# EAGLE design BusPirate-ng.v1.0 (EAGLE 7.6.0)
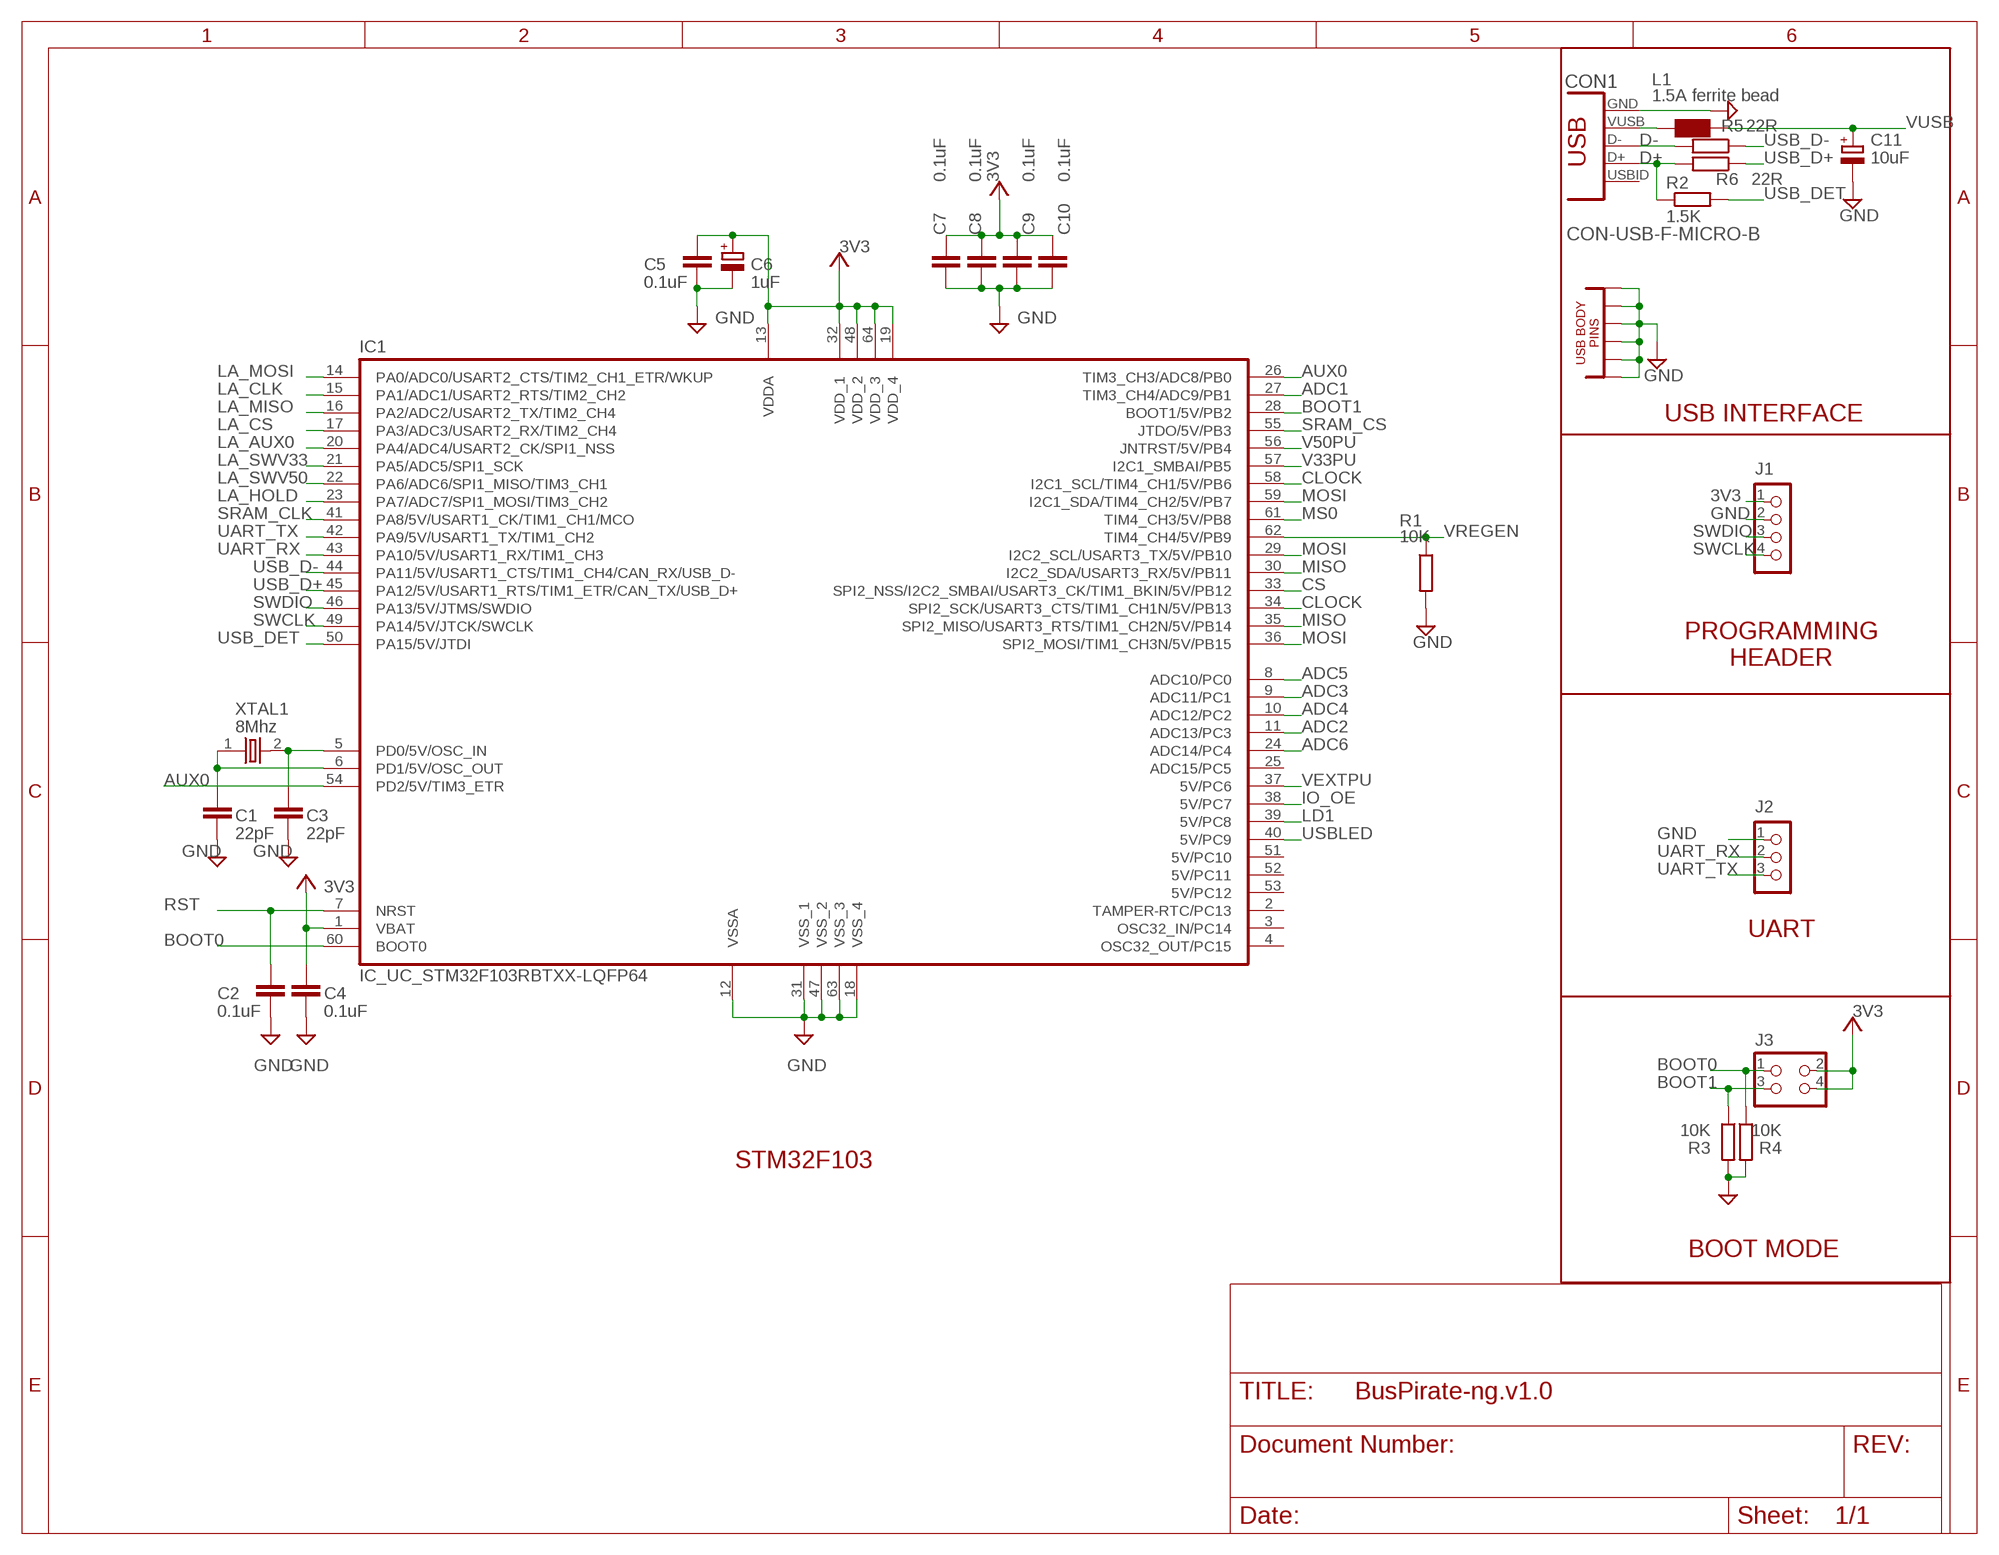
[diagram p0: schematic, sheet 1, part 1 of 2]
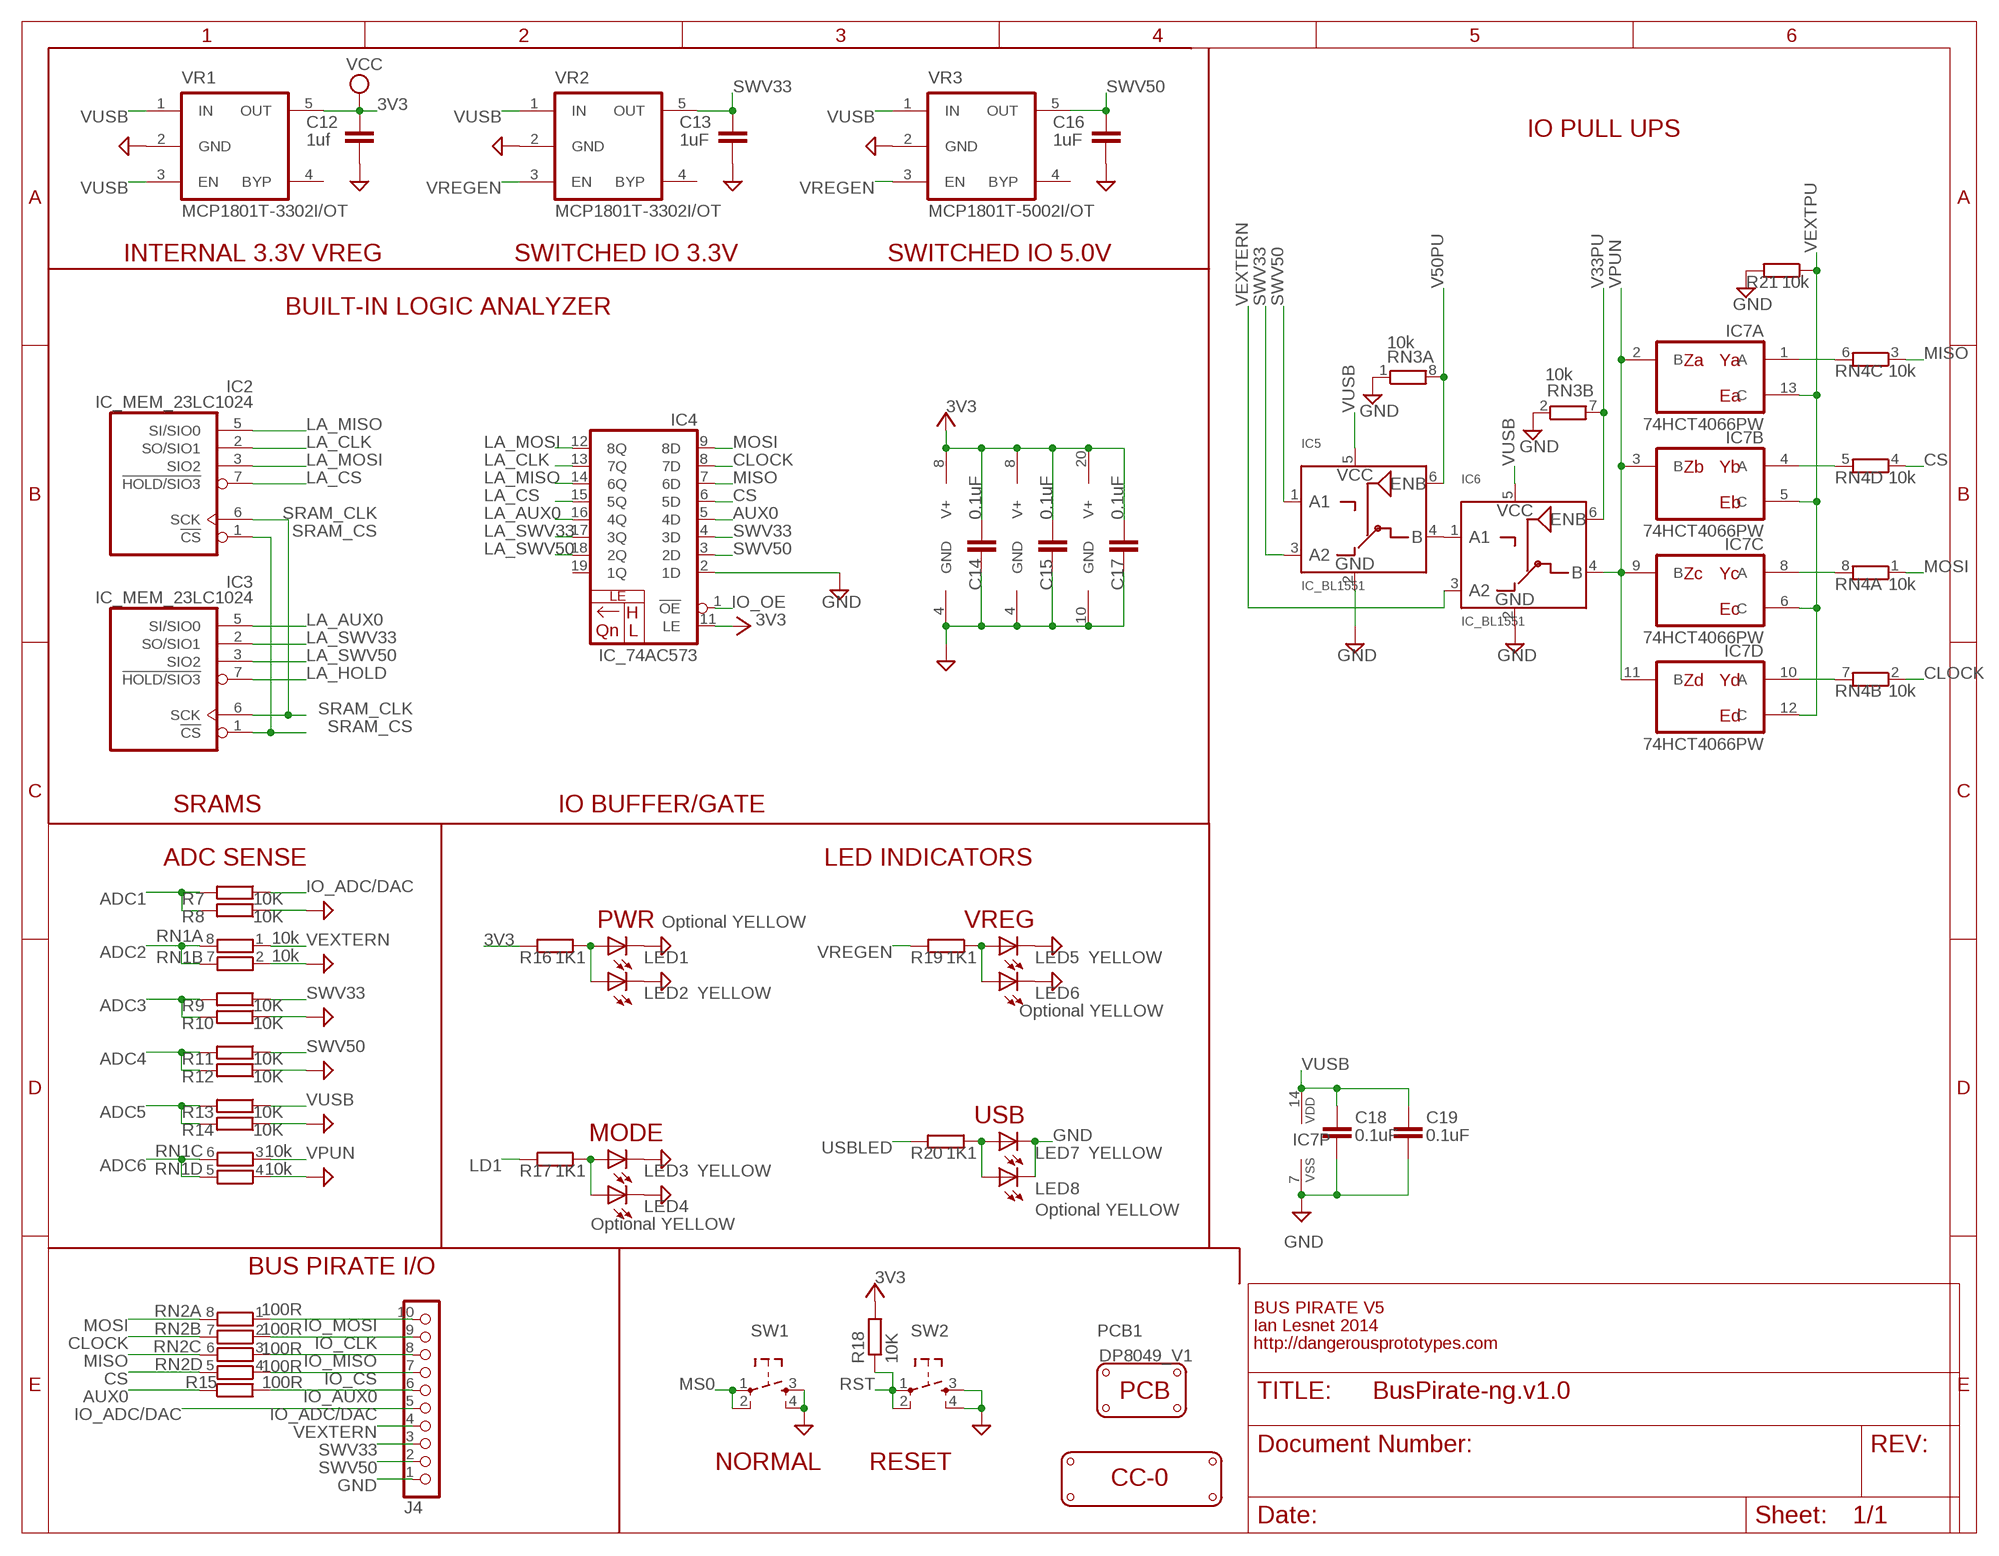
[diagram p1: schematic, sheet 1, part 2 of 2]

## Parts
C1  22pF  C-EUC0603  [C0603]
C2  0.1uF  C-EUC0603  [C0603]
C3  22pF  C-EUC0603  [C0603]
C4  0.1uF  C-EUC0603  [C0603]
C5  0.1uF  C-EUC0603  [C0603]
C6  1uF  CPOL-EUSMCA  [SMC_A]
C7  0.1uF  C-EUC0603  [C0603]
C8  0.1uF  C-EUC0603  [C0603]
C9  0.1uF  C-EUC0603  [C0603]
C10  0.1uF  C-EUC0603  [C0603]
C11  10uF  CPOL-EUSMCA  [SMC_A]
C12  1uf  C-EUC0603  [C0603]
C13  1uF  C-EUC0603  [C0603]
C14  0.1uF  C-EUC0603  [C0603]
C15  0.1uF  C-EUC0603  [C0603]
C16  1uF  C-EUC0603  [C0603]
C17  0.1uF  C-EUC0603  [C0603]
C18  0.1uF  C-EUC0603  [C0603]
C19  0.1uF  C-EUC0603  [C0603]
CON1  CON-USB-F-MICRO-B  [CON_USB_MICRO-B-1-MD05SMXXX-01]
IC1  IC_UC_STM32F103RBTXX-LQFP64  [LQFP64]
IC2  IC_MEM_23LC1024  [SOIC-8]
IC3  IC_MEM_23LC1024  [SOIC-8]
IC4  IC_74AC573  IC_74AC573-TSSOP-20  [TSSOP-20]
IC5  IC_BL1551  [SOT-363]
IC6  IC_BL1551  [SOT-363]
IC7  74HCT4066PW  4066TS  [40XX_TSSOP14]
J1  CON_HEADER_1X04  [M1X4]
J2  CON_HEADER_1X03-PTH  [M1X3]
J3  CON_HEADER_2X02-PTH  [M2X2]
J4  CON_HEADER_1X10-RIGHT_ANGLED_PTH_SHROUDED  [M1X10_MALE_RIGHT_ANGLES_PTH_SHROUDED]
L1  1.5A ferrite bead  WE-KIL_0805  [WE-KI_0805_B]
LED1  Optional YELLOW  LED-0805  [LED-805]
LED2  YELLOW  LED-0805  [LED-805]
LED3  YELLOW  LED-0805  [LED-805]
LED4  Optional YELLOW  LED-0805  [LED-805]
LED5  YELLOW  LED-0805  [LED-805]
LED6  Optional YELLOW  LED-0805  [LED-805]
LED7  YELLOW  LED-0805  [LED-805]
LED8  Optional YELLOW  LED-0805  [LED-805]
LOGO1  LOGO_CC-0  [LOGO_CC-0]
PCB1  PCB_DP_RECTANGLE-80X49  [DP8049_V1]
R1  10K  RESISTOR-0603  [R603]
R2  1.5K  RESISTOR-0603  [R603]
R3  10K  R-EU_R0603  [R0603]
R4  10K  R-EU_R0603  [R0603]
R5  22R  RESISTOR-0603  [R603]
R6  22R  RESISTOR-0603  [R603]
R7  10K  R-EU_R0603  [R0603]
R8  10K  R-EU_R0603  [R0603]
R9  10K  R-EU_R0603  [R0603]
R10  10K  R-EU_R0603  [R0603]
R11  10K  R-EU_R0603  [R0603]
R12  10K  R-EU_R0603  [R0603]
R13  10K  R-EU_R0603  [R0603]
R14  10K  R-EU_R0603  [R0603]
R15  100R  RESISTOR-0603  [R603]
R16  1K1  RESISTOR-0603  [R603]
R17  1K1  RESISTOR-0603  [R603]
R18  10K  RESISTOR-0603  [R603]
R19  1K1  RESISTOR-0603  [R603]
R20  1K1  RESISTOR-0603  [R603]
R21  10k  RESISTOR-0603  [R603]
RN1  10k  RNETWORK  [RN8P-4R-CRA06S]
RN2  100R  RNETWORK  [RN8P-4R-CRA06S]
RN3  10k  RNETWORK  [RN8P-4R-CRA06S]
RN4  10k  RNETWORK  [RN8P-4R-CRA06S]
SW1  SW_TACT_4P  [SW_TACT_SMALL]
SW2  SW_TACT_4P  [SW_TACT_SMALL]
VR1  MCP1801T-3302I/OT  MIC5205  [SOT-23-5@1]
VR2  MCP1801T-3302I/OT  MIC5205  [SOT-23-5@1]
VR3  MCP1801T-5002I/OT  MIC5205  [SOT-23-5@1]
XTAL1  8Mhz  OSC-XTAL-12M  [XTAL_4X6]

## Nets
3V3: C4.2 C5.2 C6.+ C7.2 C8.2 C9.2 C10.2 C12.1 C14.1 C15.1 C17.1 IC1.1(VBAT) IC1.13(VDDA) IC1.19(VDD_4) IC1.32(VDD_1) IC1.48(VDD_2) IC1.64(VDD_3) IC2.8(V+) IC3.8(V+) IC4.11(LE) IC4.20(V+) J1.1 J3.2 J3.4 R16.2 R18.2 VR1.5(OUT) ; supply symbol labelled VCC, V+
ADC1: IC1.27(TIM3_CH4/ADC9/PB1) R7.2 R8.2
ADC2: IC1.11(ADC13/PC3) RN1.7 RN1.8
ADC3: IC1.9(ADC11/PC1) R9.2 R10.2
ADC4: IC1.10(ADC12/PC2) R11.2 R12.2
ADC5: IC1.8(ADC10/PC0) R13.2 R14.2
ADC6: IC1.24(ADC14/PC4) RN1.5 RN1.6
AUX0: IC1.26(TIM3_CH3/ADC8/PB0) IC1.54(PD2/5V/TIM3_ETR) IC4.5(4D) R15.1
BOOT0: IC1.60(BOOT0) J3.1 R4.1
BOOT1: IC1.28(BOOT1/5V/PB2) J3.3 R3.1
CLOCK: IC1.34(SPI2_SCK/USART3_CTS/TIM1_CH1N/5V/PB13) IC1.58(I2C1_SCL/TIM4_CH1/5V/PB6) IC4.8(7D) RN2.7 RN4.2
CS: IC1.33(SPI2_NSS/I2C2_SMBAI/USART3_CK/TIM1_BKIN/5V/PB12) IC4.6(5D) RN2.5 RN4.4
D+: CON1.P3(D+) R2.1 R6.2
D-: CON1.P2(D-) R5.2
EXVUSB: CON1.P1(VUSB) L1.2
GND: C1.1 C2.1 C3.1 C4.1 C5.1 C6.- C7.1 C8.1 C9.1 C10.1 C11.- C12.2 C13.2 C14.2 C15.2 C16.2 C17.2 C18.2 C19.2 CON1.GND1 CON1.GND2 CON1.GND3 CON1.GND4 CON1.GND5 CON1.GND6 CON1.P5(GND) IC1.12(VSSA) IC1.18(VSS_4) IC1.31(VSS_1) IC1.47(VSS_2) IC1.63(VSS_3) IC2.4(GND) IC3.4(GND) IC4.2(1D) IC4.10(GND) IC5.2(GND) IC6.2(GND) IC7.7(P:VSS) J1.2 J2.1 J4.1 LED1.C LED2.C LED3.C LED4.C LED5.C LED6.C LED7.C LED8.C R1.2 R3.2 R4.2 R8.1 R10.1 R12.1 R14.1 R21.2 RN1.2 RN1.4 RN3.1 RN3.2 SW1.3 SW1.4 SW2.3 SW2.4 VR1.2(GND) VR2.2(GND) VR3.2(GND)
IO_ADC/DAC: J4.5 R7.1
IO_AUX0: J4.6 R15.2
IO_CLK: J4.9 RN2.2
IO_CS: J4.7 RN2.4
IO_MISO: J4.8 RN2.3
IO_MOSI: J4.10 RN2.1
IO_OE: IC1.38(5V/PC7) IC4.1(!OE)
LA_AUX0: IC1.20(PA4/ADC4/USART2_CK/SPI1_NSS) IC3.5(SI/SIO0) IC4.16(4Q)
LA_CLK: IC1.15(PA1/ADC1/USART2_RTS/TIM2_CH2) IC2.2(SO/SIO1) IC4.13(7Q)
LA_CS: IC1.17(PA3/ADC3/USART2_RX/TIM2_CH4) IC2.7(!HOLD/SIO3) IC4.15(5Q)
LA_HOLD: IC1.23(PA7/ADC7/SPI1_MOSI/TIM3_CH2) IC3.7(!HOLD/SIO3)
LA_MISO: IC1.16(PA2/ADC2/USART2_TX/TIM2_CH4) IC2.5(SI/SIO0) IC4.14(6Q)
LA_MOSI: IC1.14(PA0/ADC0/USART2_CTS/TIM2_CH1_ETR/WKUP) IC2.3(SIO2) IC4.12(8Q)
LA_SWV33: IC1.21(PA5/ADC5/SPI1_SCK) IC3.2(SO/SIO1) IC4.17(3Q)
LA_SWV50: IC1.22(PA6/ADC6/SPI1_MISO/TIM3_CH1) IC3.3(SIO2) IC4.18(2Q)
LD1: IC1.39(5V/PC8) R17.2
MISO: IC1.30(I2C2_SDA/USART3_RX/5V/PB11) IC1.35(SPI2_MISO/USART3_RTS/TIM1_CH2N/5V/PB14) IC4.7(6D) RN2.6 RN4.3
MOSI: IC1.29(I2C2_SCL/USART3_TX/5V/PB10) IC1.36(SPI2_MOSI/TIM1_CH3N/5V/PB15) IC1.59(I2C1_SDA/TIM4_CH2/5V/PB7) IC4.9(8D) RN2.8 RN4.1
MS0: IC1.61(TIM4_CH3/5V/PB8) SW1.1 SW1.2
N$1: IC5.4(B) IC6.1(A1)
N$2: IC7.1(A:A) RN4.6
N$3: IC7.4(B:A) RN4.5
N$4: IC7.8(C:A) RN4.8
N$5: IC7.10(D:A) RN4.7
N$6: LED3.A LED4.A R17.1
N$7: LED1.A LED2.A R16.1
N$13: LED7.A LED8.A R20.1
N$16: C3.2 IC1.5(PD0/5V/OSC_IN) XTAL1.2
N$18: LED5.A LED6.A R19.1
N$20: C1.2 IC1.6(PD1/5V/OSC_OUT) XTAL1.1
RST: C2.2 IC1.7(NRST) R18.1 SW2.1 SW2.2
SRAM_CLK: IC1.41(PA8/5V/USART1_CK/TIM1_CH1/MCO) IC2.6(SCK) IC3.6(SCK)
SRAM_CS: IC1.55(JTDO/5V/PB3) IC2.1(!CS) IC3.1(!CS)
SWCLK: IC1.49(PA14/5V/JTCK/SWCLK) J1.4
SWDIO: IC1.46(PA13/5V/JTMS/SWDIO) J1.3
SWV33: C13.1 IC4.4(3D) IC5.3(A2) J4.3 R9.1 VR2.5(OUT)
SWV50: C16.1 IC4.3(2D) IC5.1(A1) J4.2 R11.1 VR3.5(OUT)
UART_RX: IC1.43(PA10/5V/USART1_RX/TIM1_CH3) J2.2
UART_TX: IC1.42(PA9/5V/USART1_TX/TIM1_CH2) J2.3
USB_D+: IC1.45(PA12/5V/USART1_RTS/TIM1_ETR/CAN_TX/USB_D+) R6.1
USB_D-: IC1.44(PA11/5V/USART1_CTS/TIM1_CH4/CAN_RX/USB_D-) R5.1
USB_DET: IC1.50(PA15/5V/JTDI) R2.2
USBLED: IC1.40(5V/PC9) R20.2
V33PU: IC1.57(I2C1_SMBAI/PB5) IC6.6(ENB) RN3.7
V50PU: IC1.56(JNTRST/5V/PB4) IC5.6(ENB) RN3.8
VEXTERN: IC6.3(A2) J4.4 RN1.1
VEXTPU: IC1.37(5V/PC6) IC7.5(B:C) IC7.6(C:C) IC7.12(D:C) IC7.13(A:C) R21.1
VPUN: IC6.4(B) IC7.2(A:B) IC7.3(B:B) IC7.9(C:B) IC7.11(D:B) RN1.3
VREGEN: IC1.62(TIM4_CH4/5V/PB9) R1.1 R19.2 VR2.3(EN) VR3.3(EN)
VUSB: C11.+ C18.1 C19.1 IC5.5(VCC) IC6.5(VCC) IC7.14(P:VDD) L1.1 R13.1 VR1.1(IN) VR1.3(EN) VR2.1(IN) VR3.1(IN)
Unconnected: CON1.P4(USBID) IC1.2(TAMPER-RTC/PC13) IC1.3(OSC32_IN/PC14) IC1.4(OSC32_OUT/PC15) IC1.25(ADC15/PC5) IC1.51(5V/PC10) IC1.52(5V/PC11) IC1.53(5V/PC12) IC4.19(1Q) RN3.3 RN3.4 RN3.5 RN3.6 VR1.4(BYP) VR2.4(BYP) VR3.4(BYP)

## Notes on the sheet
- IO PULL UPS
- INTERNAL 3.3V VREG | SWITCHED IO 3.3V | SWITCHED IO 5.0V
- BUILT-IN LOGIC ANALYZER
- Za | Ya
- Ea
- USB INTERFACE
- Zb | Yb
- Eb
- Zc | Yc
- Ec
- PROGRAMMING
  HEADER
- Zd | Yd
- Ed
- SRAMS | IO BUFFER/GATE
- ADC SENSE | LED INDICATORS
- PWR | VREG
- UART
- USB
- MODE
- STM32F103
- BOOT MODE
- BUS PIRATE I/O
- BUS PIRATE V5
- Ian Lesnet 2014
- http://dangerousprototypes.com
- NORMAL | RESET

## Library data of the parts
C1-C5 C7-C10 C12-C19 = rcl:C-EU: CAPACITOR, European symbol
C6 C11 = rcl:CPOL-EU: POLARIZED CAPACITOR, European symbol
CON1 = dp_devices.v6:CON-USB-F-MICRO-B: Micro USB 5P/F B Type SMT 1-MD05SMXXX-01
IC1 = dp_devices:IC_UC_STM32F103RBTXX: 32-bit ARM-based MCU with 64 or 128KB Flash
IC2 IC3 = dp_devices:IC_MEM_23LC1024: 1Mbit SPI SRAM with Serial dual interface and Serial quad interface
IC4 = dp_devices:IC_74AC573: 8 Transparent Latch with 3-state output Mfr no: SN74AC573NSR Digikey <http://www.digikey.com/product-detail/en/SN74AC573NSR/296-29119-1-ND/2690568>
IC5 IC6 = dp_devices.v6:IC_BL1551: BL1551 Low Voltage SPDT Analog Switch
IC7 = 40xx:4066: Quad bilateral ANALOG SWITCH
J1 = dp_devices.v6:CON_HEADER_1X04
J2 = dp_devices.v6:CON_HEADER_1X03
J3 = dp_devices:CON_HEADER_2X02
J4 = dp_devices.v6:CON_HEADER_1X10
L1 = wuerth-elektronik:WE-KIL: SMD Wire Wound Ceramic Inductor WE-KIL - Low profile - High Q values -- Bluetooth -- Wireless LAN -- RF oscillation circuit -- IF impedance matching
LED1-LED8 = dp_devices.v6:LED: Light Emitting Diode
LOGO1 = dp_devices:LOGO_CC-0
PCB1 = dp_devices:PCB_DP_RECTANGLE: Dangerous Prototypes Standard Rectangular PCB sizes; PCB_SIZE: DP8049_V1
R1 R16 R17 R19-R21 = dp_devices:RESISTOR
R2 R5 R6 R15 R18 = dp_devices.v6:RESISTOR
R3 R4 = rcl:R-EU_: RESISTOR, European symbol
R7-R14 = resistor:R-EU_: RESISTOR, European symbol
RN1-RN4 = dp_devices:RNETWORK: 4 Resistor Array 0603
SW1 SW2 = dp_devices.v6:SW_TACT_4P
VR1-VR3 = dp_devices:MIC5205: 150ma Low-Noise LDO Regulator
XTAL1 = dp_devices:OSC-XTAL

## Board
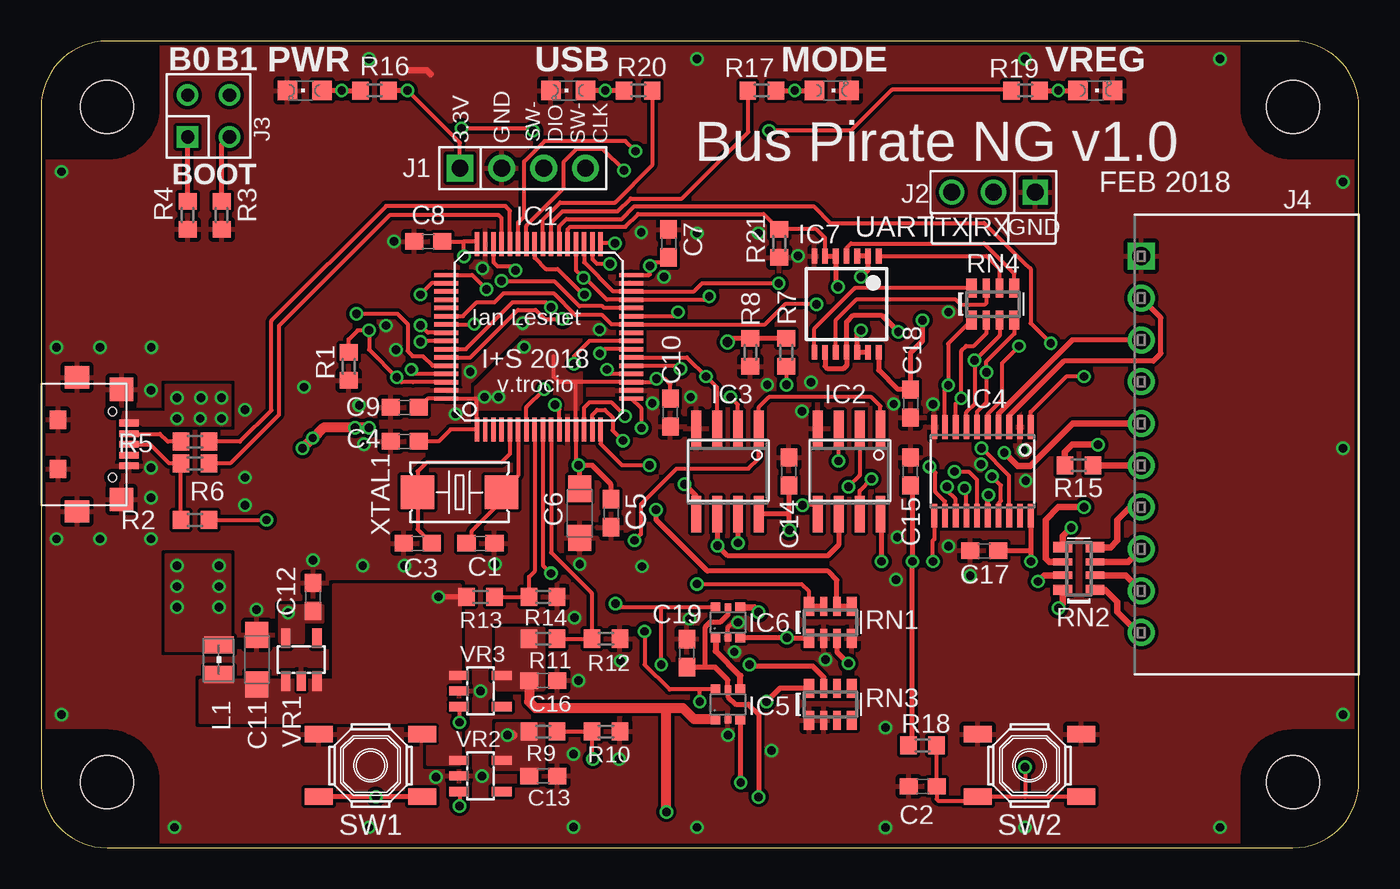
[diagram p2: board, top side]
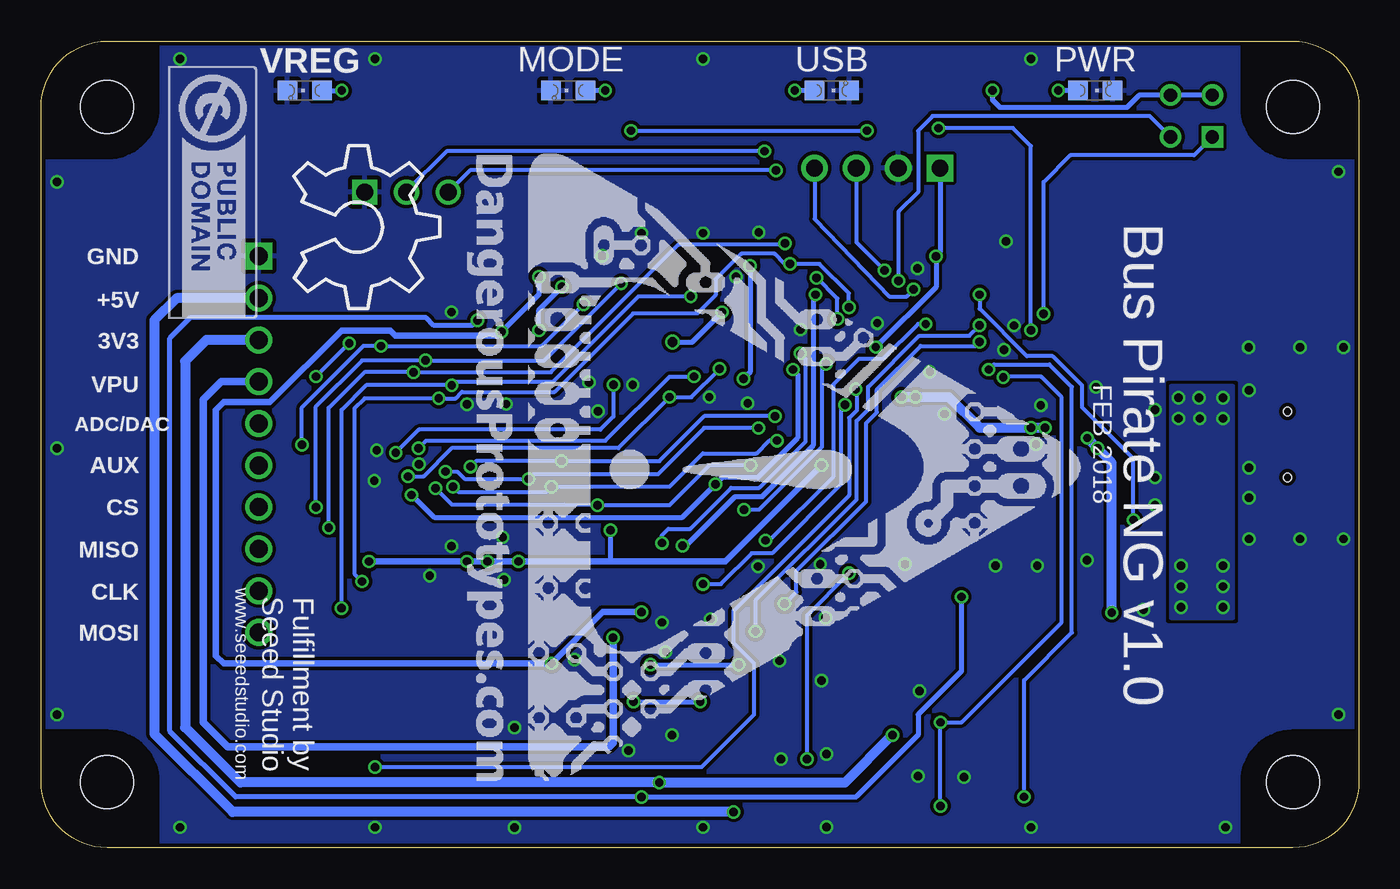
[diagram p3: board, bottom side, seen from below]

Size 80 x 49 mm. Coordinates in mm from the lower left corner, seen from the top.
Copper layers (1*16): Top 0.035mm / dielectric 1.5mm / Bottom 0.035mm
Design rules "dirt_cheap_dirty_boards.v1.1": minimum track width 6mil, minimum drill 12mil, track to track 6mil, track to pad 6mil, pad to pad 6mil, via to via 6mil, smd to smd 0mil, copper to edge 10mil, drill to drill 10mil, minimum pad ring 10mil, minimum via ring 6mil, stop-mask expansion 2mil, vias tented up to drill 25mil, thermal gap 10mil

### Footprints (pad centres in the part's own frame; a part is rotated, then mirrored left to right if it is on the bottom)
C0603 = smd 1.1 x 1: 1 -0.85,0; 2 0.85,0
SMC_A = smd 1.6 x 1.4: + -1.5,0; - 1.5,0
CON_USB_MICRO-B-1-MD05SMXXX-01 = smd 1.35 x 1.5: GND1 -4.075,0; GND2 4.075,0 | smd 1.4 x 1.4: GND3 -3.35,2.7; GND4 3.35,2.7 | smd 1.1 x 1: GND5 -1.5,-1.15; GND6 1.5,-1.15 | smd 0.4 x 1.2: P1 -1.3,3.16; P2 -0.65,3.16; P3 0,3.16; P4 0.65,3.16; P5 1.3,3.16 | hole 0.5: -2,2.15; 2,2.15
LQFP64 = smd 1.45 x 0.27: 1 -5.625,3.75; 2 -5.625,3.25; 3 -5.625,2.75; 4 -5.625,2.25; 5 -5.625,1.75; 6 -5.625,1.25; 7 -5.625,0.75; 8 -5.625,0.25; 9 -5.625,-0.25; 10 -5.625,-0.75; 11 -5.625,-1.25; 12 -5.625,-1.75; 13 -5.625,-2.25; 14 -5.625,-2.75; 15 -5.625,-3.25; 16 -5.625,-3.75; 33 5.625,-3.75; 34 5.625,-3.25; 35 5.625,-2.75; 36 5.625,-2.25; 37 5.625,-1.75; 38 5.625,-1.25; 39 5.625,-0.75; 40 5.625,-0.25; 41 5.625,0.25; 42 5.625,0.75; 43 5.625,1.25; 44 5.625,1.75; 45 5.625,2.25; 46 5.625,2.75; 47 5.625,3.25; 48 5.625,3.75 | smd 0.27 x 1.45: 17 -3.75,-5.625; 18 -3.25,-5.625; 19 -2.75,-5.625; 20 -2.25,-5.625; 21 -1.75,-5.625; 22 -1.25,-5.625; 23 -0.75,-5.625; 24 -0.25,-5.625; 25 0.25,-5.625; 26 0.75,-5.625; 27 1.25,-5.625; 28 1.75,-5.625; 29 2.25,-5.625; 30 2.75,-5.625; 31 3.25,-5.625; 32 3.75,-5.625; 49 3.75,5.625; 50 3.25,5.625; 51 2.75,5.625; 52 2.25,5.625; 53 1.75,5.625; 54 1.25,5.625; 55 0.75,5.625; 56 0.25,5.625; 57 -0.25,5.625; 58 -0.75,5.625; 59 -1.25,5.625; 60 -1.75,5.625; 61 -2.25,5.625; 62 -2.75,5.625; 63 -3.25,5.625; 64 -3.75,5.625
SOIC-8 = smd 0.6 x 2.2: 1 -1.905,-2.6; 2 -0.635,-2.6; 3 0.635,-2.6; 4 1.905,-2.6; 5 1.905,2.6; 6 0.635,2.6; 7 -0.635,2.6; 8 -1.905,2.6
TSSOP-20 = smd 0.35 x 1.43: 1 -2.925,-2.7; 2 -2.275,-2.7; 3 -1.625,-2.7; 4 -0.975,-2.7; 5 -0.325,-2.7; 6 0.325,-2.7; 7 0.975,-2.7; 8 1.625,-2.7; 9 2.275,-2.7; 10 2.925,-2.7; 11 2.925,2.7; 12 2.275,2.7; 13 1.625,2.7; 14 0.975,2.7; 15 0.325,2.7; 16 -0.325,2.7; 17 -0.975,2.7; 18 -1.625,2.7; 19 -2.275,2.7; 20 -2.925,2.7
SOT-363 = smd 0.6 x 0.6: 1 -0.75,-0.9; 3 0.75,-0.9; 4 0.75,0.9; 6 -0.75,0.9 | smd 0.4 x 0.5: 2 0,-0.9; 5 0,0.9
40XX_TSSOP14 = smd 0.35 x 0.9: 1 -1.95,-2.925; 2 -1.3,-2.925; 3 -0.65,-2.925; 4 0,-2.925; 5 0.65,-2.925; 6 1.3,-2.925; 7 1.95,-2.925; 8 1.95,2.925; 9 1.3,2.925; 10 0.65,2.925; 11 0,2.925; 12 -0.65,2.925; 13 -1.3,2.925; 14 -1.95,2.925
M1X4 = drill 1.02 pad 1.632 square: 1 0,0 | drill 1.02 pad 1.632: 2 2.54,0; 3 5.08,0; 4 7.62,0
M1X3 = drill 1.02 square: 1 0,0 | drill 1.02: 2 2.54,0; 3 5.08,0
M2X2 = drill 0.8 square: 1 -1.27,-1.27 | drill 0.8: 2 -1.27,1.27; 3 1.27,-1.27; 4 1.27,1.27
M1X10_MALE_RIGHT_ANGLES_PTH_SHROUDED = drill 1.09 square: 1 -11.43,-6.415 | drill 1.09: 2 -8.89,-6.415; 3 -6.35,-6.415; 4 -3.81,-6.415; 5 -1.27,-6.415; 6 1.27,-6.415; 7 3.81,-6.415; 8 6.35,-6.415; 9 8.89,-6.415; 10 11.43,-6.415
WE-KI_0805_B = smd 1.02 x 1.78: 1 -0.89,0; 2 0.89,0
LED-805 = smd 1.2 x 1.2: A 0,-1.05; C 0,1.05
DP8049_V1 = hole 3.2: -36,-20.5; 36,-20.5; 36,20.5; -36,20.5
R603 = smd 1 x 1.1: 1 -0.85,0; 2 0.85,0
R0603 = smd 1 x 1.1: 1 -0.85,0; 2 0.85,0
RN8P-4R-CRA06S = smd 0.63 x 1.15: 1 -1.295,-0.975; 4 1.295,-0.975; 5 1.295,0.975; 8 -1.295,0.975 | smd 0.44 x 1.15: 2 -0.4,-0.975; 3 0.4,-0.975; 6 0.4,0.975; 7 -0.4,0.975
SW_TACT_SMALL = smd 1.7 x 1: 1 -3.15,1.9; 2 3.15,1.9; 3 -3.15,-1.9; 4 3.15,-1.9
SOT-23-5@1 = smd 0.55 x 1.2: 1 -0.95,-1.3; 2 0,-1.3; 3 0.95,-1.3; 4 0.95,1.3; 5 -0.95,1.3
XTAL_4X6 = smd 2.032 x 2.032: 1 -2.54,0; 2 2.54,0

### Placement (x,y rotation side)
C1  26.67,18.49 180 top
C2  53.52,3.73 0 top
C3  22.86,18.49 0 top
C4  22.07,24.69 0 top
C5  34.61,20.32 90 top
C6  32.7,20.32 270 top
C7  38.1,36.72 270 top
C8  23.5,36.83 0 top
C9  22.07,26.75 0 top
C10  38.21,26.44 90 top
C11  13.1,11.43 90 top
C12  16.51,15.24 90 top
C13  30.48,4.37 0 top
C14  45.4,22.86 90 top
C15  52.78,22.86 90 top
C16  30.48,10.16 0 top
C17  57.25,18.05 180 top
C18  52.78,26.99 270 top
C19  39.2,11.82 90 top
CON1  2.18,24.5 270 top
IC1  30.21,31.04 90 top
IC2  49.05,22.86 180 top
IC3  41.67,22.86 180 top
IC4  57.15,22.86 180 top
IC5  41.69,8.71 0 top
IC6  41.69,13.69 0 top
IC7  48.9,33.02 180 top
J1  25.43,41.29 0 top
J2  60.36,39.83 180 top
J3  10.16,44.45 0 top
J4  73.2,24.5 270 top
L1  10.79,11.43 90 top
LED1  16,46 270 bottom
LED2  16,46 90 top
LED3  48,46 270 top
LED4  48,46 90 bottom
LED5  64,46 270 top
LED6  64,46 90 bottom
LED7  32,46 90 top
LED8  32,46 270 bottom
LOGO1  72.27,47.47 270 bottom
PCB1  40,24.5 0 top
R1  18.67,29.25 270 top
R2  9.33,19.91 0 top
R3  10.95,38.43 270 top
R4  8.89,38.43 270 top
R5  9.34,24.67 180 top
R6  9.33,23.35 180 top
R7  45.24,30.09 90 top
R8  43.06,30.09 90 top
R9  30.48,7.06 0 top
R10  34.29,7.06 180 top
R11  30.48,12.7 0 top
R12  34.29,12.7 180 top
R13  26.67,15.24 0 top
R14  30.48,15.24 180 top
R15  63,23.23 0 top
R16  20.25,46 0 top
R17  43.75,46 180 top
R18  53.52,6.22 180 top
R19  59.75,46 180 top
R20  36.25,46 0 top
R21  44.81,36.72 270 top
RN1  47.92,13.69 0 top
RN2  63.01,16.96 90 top
RN3  47.92,8.71 0 top
RN4  57.78,33.02 0 top
SW1  20,5 180 top
SW2  60,5 180 top
U$1  [DP-LOGO]  61.84,-11.22 0 top  (outside the outline)
U$2  [OSHW_8X350_NOTEXT]  64.67,42.67 270 bottom
U$4  [DP_LOGO_ART_1.5X1.5]  54.12,42.15 270 bottom
VR1  15.8,11.43 0 top
VR2  26.67,4.37 270 top
VR3  26.67,9.53 270 top
XTAL1  25.4,21.59 180 top

### Tracks (layer width: path | path; a pad name or v marks a point on that pad's centre or on a via)
3V3  (via drill 0.51)
  Top 0.254: C8.2 25.67,36.83 | C4.2 24.13,24.69 24.86,25.41 IC1.1 26.46,27.26 26.43,27.29 IC1.64 23.46,27.29 C9.2 | C7.2 38.1,35.56 37.17,35.56 v36.96,35.35 36.96,34.85 36.91,34.79 IC1.32 35.77,34.79 | 32.46,28.29 IC1.19 37.14,28.29 v37.35,28.5 37.85,28.5 38.21,28.14 C10.2 | 32.46,28.29 IC1.13 32.46,23.4 | IC4.11 54.23,18.75 54.14,18.67 v54.14,17.4 | 32.46,28.29 31.45,28.29 31.11,28.63 31.11,29.87 | v25.67,35.94 25.67,36.83 | IC1.48 26.46,36.83 25.67,36.83 | 52.9,6.45 R18.2 | J1.1 25.43,42.83 v22.25,46
  Top 0.305: v22.25,46 R16.2 | 51.02,20.32 IC2.8 51.03,20.19 v51.03,17.4 | IC3.8 43.64,20.32 45.37,20.32 45.43,20.38 | IC4.20 60.08,20.31 60.09,20.32 60.09,18.05 | 60.09,18.05 v60.09,17.4 | 32.46,23.4 v32.62,23.24 | C5.2 34.61,22.07 33.43,23.24 v32.62,23.24 | C6.+ 32.7,23.16 v32.62,23.24 | IC4.11 54.23,20.32 | C15.1 52.9,21.9 v52.9,17.4 52.9,6.45 | C17.1 60.09,18.05 | v45.43,19.29 45.43,20.38 | 45.43,20.38 45.43,21.98 C14.1
  Top 0.61: v19.91,25.51 17.13,25.51 16.51,24.89 v16.49,24.89 v15.87,24.27
  Bottom 0.305: 46.67,17.4 49.76,17.4 49.78,17.42 45.43,17.42 v45.43,19.29 | J3.2 J3.4 13.32,45.72 14.08,44.96 21.78,44.96 22.25,45.43 v22.25,46 | v36.96,35.35 36.96,28.89 v37.35,28.5 | v29.33,30.41 25.67,34.07 v25.67,35.94 25.43,36.18 J1.1
  Bottom 0.406: v32.62,23.24 38.47,17.4 46.67,17.4 v51.03,17.4 v52.9,17.4 v54.14,17.4 v60.09,17.4
  Bottom 0.61: 16.51,24.87 v16.49,24.89 v15.87,24.27 15,23.4 v15,14.29 | v19.06,25.51 v19.91,25.51 23.02,25.51 24.89,27.38 v26.91,27.38 v26.92,27.38 v27.77,27.38
  pour Top (isolate 0.152, no thermals): 29.29,30.84 32.76,30.84 32.76,26.65 26.41,26.65 26.41,27.97
  pour Top (no thermals): 14.53,14.68 17.07,14.68 17.07,13.73 15.88,13.73 15.88,12.46 14.53,12.46
ADC1  (via drill 0.51, 0.58)
  Top 0.254: IC1.27 38.4,32.29 v38.66,32.54
  Top 0.305: 41.63,30.68 v41.67,30.72 41.9,30.94 R8.2 R7.2
  Bottom 0.305: v41.67,30.72 40.48,30.72 v38.66,32.54
ADC2  (via drill 0.51)
  Top 0.254: v39.83,16.02 46.16,16.02 46.62,15.56 RN1.8 | IC1.11 31.46,26.65 v31.2,26.91
  Top 0.305: RN1.7 RN1.8
  Bottom 0.254: v39.83,16.02 38.74,16.02 36.87,17.89 35.63,17.89 31.43,22.09 31.43,26.67 v31.2,26.91
ADC3  (via drill 0.51)
  Top 0.254: R9.2 R10.2 33.44,5.45 v33.5,5.4 | IC1.9 30.46,17.16 v30.96,16.67
  Bottom 0.254: v33.5,5.4 33.5,14.13 v30.96,16.67
ADC4
  Top 0.254: R11.2 R12.2 33.42,12.72 33.42,15.48 30.96,17.93 IC1.10
ADC5
  Top 0.254: R13.2 R14.2 29.63,16.45 29.96,16.78 IC1.8
ADC6  (via drill 0.51)
  Top 0.254: IC1.24 33.28,30.79 32.36,29.87 v32.36,29.4
  Top 0.305: v37.34,20.54 37.34,19.91 40.45,16.8 47.76,16.8 48.32,16.25 RN1.6 RN1.5
  Bottom 0.254: v37.34,20.54 36.41,20.54 32.59,24.35 32.59,29.17 v32.36,29.4
AUX0  (via drill 0.51)
  Top 0.254: v47.07,33.02 45.16,33.02 43.93,31.79 IC1.26 34.64,31.79 34.07,32.36 32.44,32.36 31.11,33.68 28.08,33.68 27.54,33.14 26.45,33.14 25.6,32.29 IC1.54 | IC4.5 57.48,26.36 58.34,27.23 58.34,29.44 v59.38,30.48
  Top 0.406: v64.17,24.48 62.6,24.48 62.15,24.04 R15.1
  Bottom 0.254: v47.07,33.02 49.61,30.48 v59.38,30.48 60.44,30.48 64.17,26.75 v64.17,24.48
BOOT0  (via drill 0.51)
  Top 0.254: IC1.60 23.76,29.29 23.18,29.87 22.56,29.87 22.25,30.18 22.25,31.82 21.62,32.44 v19.14,32.44
  Top 0.305: R4.1 J3.1
  Bottom 0.254: J3.1 10,42.07 17.52,42.07 19.14,40.45 v19.14,32.44
BOOT1  (via drill 0.51)
  Top 0.254: IC1.28 34.19,32.79 34.07,32.9 32.67,32.9 31.19,34.38 28,34.38 v27.94,34.44
  Top 0.305: R3.1 10.95,42.7 J3.3
  Bottom 0.254: J3.3 12.7,44.45 25.87,44.45 26.76,43.56 26.76,39.83 27.93,38.66 27.93,34.46 v27.94,34.44
CLOCK  (via drill 0.51)
  Top 0.254: IC4.8 55.52,26.97 v55.86,27.3 55.86,30.19 56.16,30.49 56.63,30.49 57.38,31.25 RN4.2 | IC1.58 25.78,30.29 28.63,33.14 30.65,33.14 v30.96,32.83 | v34.54,35.47 33.76,35.47 33.46,35.77 IC1.34
  Top 0.406: RN2.7 60.9,16.56 v60.52,16.18
  Bottom 0.254: v60.52,16.18 60.98,16.65 60.98,26.68 60.36,27.3 v55.86,27.3 54.84,27.3 54.45,27.69 48.83,27.69 44.06,32.46 40.16,32.46 39.05,33.58 39.05,34.54 37.49,36.09 35.47,36.09 34.85,35.47 v34.54,35.47 32.75,35.47 30.96,33.68 v30.96,32.83
CS  (via drill 0.51)
  Top 0.254: IC4.6 56.83,26.49 57.39,27.05 v57.39,28.89 57.39,29.54 59.08,31.23 RN4.4 | v34.84,36.72 34.02,36.72 IC1.33
  Top 0.406: RN2.5 62.03,18.94 v62.54,19.45
  Bottom 0.254: v62.54,19.45 62.54,26.71 60.36,28.89 v57.39,28.89 49.06,28.89 41.31,36.64 34.93,36.64 v34.84,36.72
D+
  Top 0.254: CON1.P3 6.62,24.5 7.76,23.35 R6.2 R2.1
D-
  Top 0.254: CON1.P2 7.21,25.15 7.69,24.67 R5.2
EXVUSB  (via drill 0.51)
  other vias: 9.71,27.34 10.95,27.34 10.95,26.07 8.26,26.07 8.26,27.34 9.66,26.07 10.79,17.14 8.26,17.14 8.26,15.88 10.79,15.88 10.79,14.61 8.26,14.61
  pour Top (isolate 0.305, no thermals): 4.99,26.43 7.62,26.43 7.62,28.09 11.43,28.09 11.43,25.68 4.99,25.68
  pour Top (no thermals): 7.62,17.78 11.43,17.78 11.43,11.99 7.62,11.99
  pour Bottom: 7.62,28.04 11.43,28.04 11.43,13.97 7.62,13.97
GND  (via drill 0.51)
  Top 0.254: 41.69,12.76 41.69,13.38 42.01,13.69 v42.32,13.69
  Top 0.406: 22.38,47.23 23.42,47.23 23.65,46.99
  other vias: 19.6,24.52 44.08,28.12 71.56,47.92 19.91,47.92 32.33,5.68 55.09,32.54 19.91,1.24 26.05,28.91 39.83,1.24 45.96,35.96 0.93,18.76 39.83,37.34 42.08,11.9 79.03,40.45 12.37,20.81 36.49,17.09 39.44,27.38 16.51,17.46 22.07,17.14 19.31,26.88 23.97,4.29 59.74,47.92 79.03,24.27 8.09,1.24 6.68,23.09 12.37,26.61 6.68,18.76 79.03,8.09 43.56,37.34 37.8,34.69 32.62,10.16 39.83,47.92 35.16,11.35 21.43,36.83 13.07,14.47 71.56,1.24 1.24,41.07 32.7,17.22 35.08,5.4 1.24,8.09 51.27,7.3 6.68,21.26 59.74,1.24 46.74,28.27 46.2,26.52 36.43,37.39 19.53,17.14 15.95,27.99 27.54,17.22 3.58,18.76 25.16,26.35 12.37,22.49 32.38,13.97 26.67,9.53 26.76,4.36 56.41,16.52 59.62,24.16 6.69,30.4 6.68,27.79 0.93,30.4 41.69,6.85 59.78,22.29 3.58,30.4 54.16,26.94 44.35,5.9 51.27,1.23 32.33,1.25 57.06,23.3 51.77,26.96 55.09,18.31 51.98,18.86 51.9,16.29 47.61,11.42 39.37,13.9 26.8,35.2 29.24,31.87 33.91,31.48 37.1,26.99 20.93,31.72 21.55,30.24
  pour Top (isolate 0.203, rank 2): 0,48.97 80.01,48.97 80.01,0 0,0
  pour Bottom (isolate 0.203, rank 2): 0,48.97 80.01,48.97 arc-3 80.01,0 0,0
IO_ADC/DAC  (via drill 0.51)
  Top 0.254: v45.26,28.13 45.26,29.22 R7.1
  Top 0.406: J4.5 62.64,25.77 60.05,23.18 59.29,23.18 v58.47,24
  Bottom 0.254: v58.47,24 57.07,25.4 46.05,25.4 45.26,26.19 v45.26,28.13
IO_AUX0
  Top 0.406: J4.6 R15.2
IO_CLK
  Top 0.406: RN2.2 65.84,16.56 J4.9
IO_CS
  Top 0.406: RN2.4 64.92,18.25 65.34,18.67 65.34,19.91 66.12,20.69 J4.7
IO_MISO
  Top 0.406: RN2.3 66,17.36 J4.8
IO_MOSI
  Top 0.406: RN2.1 64.61,15.66 65.34,14.94 65.34,14.31 66.58,13.07 J4.10
IO_OE  (via drill 0.51)
  Top 0.254: v61.3,30.65 60.08,31.87 60.08,35.17 59.74,35.47 57.25,37.96 47.92,37.96 46.91,38.97 36.02,38.97 35.24,38.19 31.89,38.19 31.46,37.76 IC1.38 | v63.32,28.63 62.23,28.63 60.08,26.47 IC4.1
  Bottom 0.254: v61.3,30.65 v63.32,28.63
LA_AUX0  (via drill 0.51)
  Top 0.254: IC1.20 34.61,28.79 v34.35,29.05
  Top 0.305: IC4.16 57.48,21.39 v57.51,21.43 | IC3.5 39.77,21.37 v39.05,22.09
  Bottom 0.305: v34.35,29.05 34.07,28.77 34.07,24.89 36.48,22.48 38.66,22.48 v39.05,22.09 41.07,20.07 56.15,20.07 v57.51,21.43
LA_CLK  (via drill 0.51)
  Top 0.254: IC2.2 49.69,22.62 v49.01,21.94 | IC4.13 55.52,21.17 55,21.7 v55,21.94 | IC1.15 33.46,26.3 33.76,26.6 34.23,26.6 34.69,26.14 34.69,25.36 v35.32,24.74
  Bottom 0.254: v55,21.94 54.69,21.62 49.32,21.62 v49.01,21.94 41.85,21.94 39.83,23.96 36.56,23.96 35.78,24.74 v35.32,24.74
LA_CS  (via drill 0.51)
  Top 0.254: 49.69,20.64 IC2.7 49.69,21.68 v50.41,22.4 | IC4.15 56.83,22.33 56.3,22.85 v55.45,22.85 | v36.45,25.5 36.45,26.68 IC1.17
  Top 0.305: 49.69,20.16 IC2.7
  Bottom 0.254: v36.45,25.5 39.74,25.5 42.55,22.7 50.11,22.7 v50.41,22.4 54.3,22.4 54.75,22.85 v55.45,22.85
LA_HOLD  (via drill 0.51)
  Top 0.254: IC1.23 34.18,30.29 v33.91,30.03
  Top 0.305: IC3.7 42.31,18.52 v42.32,18.51
  Bottom 0.254: v33.91,30.03 33.6,29.71 33.6,24.66 36.41,21.86 38.12,21.86 40.6,19.37 41.93,19.37 42.32,18.98 v42.32,18.51
LA_MISO  (via drill 0.51)
  Top 0.254: IC1.16 33.97,24.53 35.27,23.23 v36.94,23.23 | IC4.14 56.17,21.71 v56.05,21.83 | IC2.5 47.15,20.69 47.29,20.83 46.24,20.83 v46.23,20.82
  Bottom 0.254: v56.05,21.83 55.07,20.85 48.22,20.85 v46.23,20.82 41.85,20.82 39.43,23.23 v36.94,23.23
LA_MOSI  (via drill 0.51)
  Top 0.254: v48.42,23.5 IC2.3 | IC4.12 54.88,21.05 54.3,21.62 54.3,22.79 v53.92,23.16 | IC1.14 32.96,26.74 33.29,27.07 34.6,27.07 v35.45,26.22
  Bottom 0.254: v35.45,26.22 39.74,26.22 42.47,23.5 v48.42,23.5 53.59,23.5 v53.92,23.16
LA_SWV33  (via drill 0.51)
  Top 0.254: IC1.21 38.62,29.29 v38.82,29.09 | v57.72,22.56 58.26,22.01 58.26,21.08 58.12,20.94 IC4.17 | IC3.2 42.31,26.92 v41.85,27.38
  Bottom 0.254: v38.82,29.09 40.53,27.38 v41.85,27.38 44.96,24.27 55.07,24.27 56.78,22.56 v57.72,22.56
LA_SWV50  (via drill 0.51)
  Top 0.254: IC1.22 39.21,29.79 v40.37,28.63 41.04,27.96 IC3.3 | IC4.18 58.77,22.59 v57.1,24.27
  Bottom 0.254: v40.37,28.63 41.85,28.63 45.74,24.74 56.63,24.74 v57.1,24.27
LD1
  Top 0.254: IC1.39 30.96,37.96 31.66,38.66 35,38.66 35.78,39.44 38.89,39.44 42.94,43.48 42.94,45.96 R17.2
MISO  (via drill 0.51)
  Top 0.254: IC4.7 56.17,26.46 56.67,26.96 v56.67,29.61 58.19,31.12 RN4.3 | v44.78,34.28 40.11,34.28 39.62,33.79 IC1.30 34.74,33.79 32.96,35.57 IC1.35
  Top 0.406: v63.32,20.69 61.76,20.69 60.98,19.91 60.98,17.58 61.21,17.36 RN2.6
  Bottom 0.254: v44.78,34.28 49.45,29.61 v56.67,29.61 60.52,29.61 63.32,26.81 v63.32,20.69
MOSI  (via drill 0.51)
  Top 0.254: IC1.36 32.46,35.09 v32.92,34.63 33,34.63 34.34,33.29 IC1.29 40.29,33.29 40.5,33.5 v40.56,33.5 | RN4.1 55.07,30.62 v55.07,28.1 54.88,27.9 IC4.9 | IC1.59 26.06,29.79 28.94,32.67 30.03,32.67 30.57,32.13 v31.66,32.13
  Top 0.406: RN2.8 62.03,14.82 v61.76,14.55
  Bottom 0.254: v40.56,33.5 43.74,33.5 48.92,28.32 54.76,28.32 54.98,28.1 v55.07,28.1 60.27,28.1 61.76,26.6 v61.76,14.55 | v31.66,32.13 31.66,33.37 v32.92,34.63
MS0  (via drill 0.51)
  Top 0.254: IC1.61 22.73,28.79 v22.47,29.05
  Top 0.305: SW1.2 17.46,3.1 v20.32,3.1 22.54,3.1 SW1.1
  Bottom 0.254: v22.47,29.05 22.16,29.37 18.79,29.37 17.42,28 17.42,13.07 20.32,10.17 v20.32,3.1
N$1
  Top 0.356: IC6.1 40.94,11.95 42.44,10.45 IC5.4
N$2
  Top 0.254: IC7.1 57.4,35.95 58.19,35.16 RN4.6
N$3
  Top 0.254: IC7.4 48.9,36.45 49.16,36.72 57.25,36.72 59.08,34.89 RN4.5
N$4
  Top 0.254: RN4.8 49.4,33.99 46.95,31.54 IC7.8
N$5
  Top 0.254: RN4.7 57.38,33.12 57.25,32.98 55.85,32.98 55.54,33.29 49.47,33.29 48.24,32.06 IC7.10
N$6  (via drill 0.51)
  Top 0.305: R17.1 v45.75,46 LED4.A
  Bottom 0.305: v45.75,46 LED4.A
N$7  (via drill 0.51)
  Top 0.305: R16.1 v18.25,46 LED1.A
  Bottom 0.305: LED1.A v18.25,46
N$13  (via drill 0.51)
  Top 0.305: LED8.A v34.25,46 R20.1
  Bottom 0.305: LED8.A v34.25,46
N$16
  Top 0.254: IC1.5 28.46,23.94 27.94,23.42 23.42,23.42 22.86,22.86 XTAL1.2 22.86,19.34 C3.2
N$18  (via drill 0.51)
  Top 0.305: R19.1 v61.75,46 LED6.A
  Bottom 0.305: LED6.A v61.75,46
N$20
  Top 0.254: IC1.6 28.96,22.61 XTAL1.1 27.94,21.03 26.11,19.21 26.11,18.79 C1.2
RST  (via drill 0.51)
  Top 0.254: IC1.7 29.46,26.76 v30.54,27.84 | 57.46,3.1 59.74,3.1 | 62.54,3.1 59.74,3.1 | v59.74,4.91 59.74,3.1 | R18.1 C2.2 54.37,2.95 54.46,2.86 56.61,2.86 SW2.2
  Top 0.305: SW2.1 62.54,3.1 | SW2.2 57.46,3.1
  Bottom 0.254: v59.74,4.91 39.9,4.91 36.72,8.09 36.72,11.2 37.96,12.45 37.96,14.39 30.95,21.4 30.95,26.12 30.47,26.6 30.47,27.77 v30.54,27.84
SRAM_CLK  (via drill 0.51)
  Top 0.254: IC1.41 29.96,35.85 30.65,35.16 31.35,35.16 32.9,33.6 v32.98,33.6
  Top 0.305: IC2.6 48.42,18.39 47.76,17.74 41.69,17.74 v41.07,18.36 41.04,18.39 IC3.6
  Bottom 0.305: v41.07,18.36 40.84,18.36 37.88,21.31 36.25,21.31 33.14,24.43 33.14,33.45 v32.98,33.6
SRAM_CS  (via drill 0.51)
  Top 0.254: IC2.1 50.96,26.83 50.41,27.38 44.18,27.38 43.58,26.77 IC3.1 43.56,25.44 43.56,23.65 42.94,23.02 38.58,23.02 36.41,20.85 36.41,19.06 v36.02,18.67 | IC1.55 26.27,31.79 v26.29,31.82
  Bottom 0.254: v36.02,18.67 35.78,18.67 31.89,22.56 31.89,28.16 30.34,29.71 28.86,29.71 26.76,31.82 v26.29,31.82
SWCLK  (via drill 0.51)
  Top 0.254: IC1.49 26.17,34.79 v27.05,33.91
  Bottom 0.254: J1.4 33.05,38.2 28.5,33.5 27.46,33.5 v27.05,33.91
SWDIO  (via drill 0.51)
  Top 0.254: IC1.46 27.46,35.56 27.7,35.32 28.57,35.32 v28.81,35.09
  Bottom 0.254: J1.3 30.5,36.79 v28.81,35.09
SWV33  (via drill 0.51)
  Top 0.305: IC4.4 58.12,26.39 62.59,30.85 J4.3 | IC5.3 42.44,4 v42.47,3.97
  Top 0.61: v28.32,6.84 28.63,6.84
  Bottom 0.61: J4.3 69.96,30.85 71.25,29.56 71.25,7.31 67.91,3.97 v42.47,3.97 31.19,3.97 v28.32,6.84
  pour Top (no thermals): 30.48,7.54 30.48,4.76 27.7,4.76 27.7,7.54
SWV50  (via drill 0.51)
  Top 0.305: IC4.3 58.77,26.26 62.07,29.56 67.52,29.56 67.99,30.03 67.99,32.19 J4.2
  Top 0.61: C16.1 29.63,8.87 30,8.49 37.96,8.49 | 37.96,8.49 38.96,8.49 39.64,7.81 IC5.1 | v37.96,2.18 37.96,8.49
  Bottom 0.61: J4.2 71.78,33.39 73.12,32.05 73.12,6.92 68.38,2.18 v37.96,2.18
  pour Top (no thermals): 30.48,13.34 30.48,9.6 27.7,9.6 27.7,13.34
UART_RX  (via drill 0.51)
  Top 0.254: IC1.43 28.96,37.98 29.33,38.35 29.33,41.69 30.57,42.94 35.47,42.94 v36.09,42.32
  Bottom 0.254: J2.2 57.82,39.88 55.38,42.32 v36.09,42.32
UART_TX  (via drill 0.51)
  Top 0.254: IC1.42 29.46,37.78 31.74,40.06 31.74,41.69 32.52,42.47 34.07,42.47 v35.39,41.15
  Bottom 0.254: v35.39,41.15 53.96,41.15 J2.3
USB_D+
  Top 0.254: IC1.45 27.96,38.25 27.78,38.43 21.16,38.43 14.45,31.72 14.45,26.33 11.47,23.35 R6.1
USB_D-
  Top 0.254: IC1.44 28.46,38.7 28.18,38.99 20.94,38.99 13.97,32.02 13.97,26.57 12.07,24.67 R5.1
USB_DET  (via drill 0.51)
  Top 0.254: IC1.50 23.71,34.29 v23.02,33.6 | R2.2 v13.69,19.91
  Bottom 0.254: v23.02,33.6 23.02,32.75 20.15,29.87 18.59,29.87 16.8,28.08 16.8,26.76 13.69,23.65 v13.69,19.91
USBLED
  Top 0.254: IC1.40 30.46,38.16 31.5,39.2 34.85,39.2 37.1,41.46 R20.2
V33PU  (via drill 0.51)
  Top 0.254: IC6.6 37.65,14.59 | 37.65,14.59 35.1,14.59 v34.87,14.82 | v37.65,11.12 37.65,14.59 | IC1.57 23.09,30.79 v23.02,30.73
  Top 0.305: RN3.7 47.52,10.36 46.83,11.05 43.09,11.05 v43.02,11.12
  Bottom 0.254: v34.87,14.82 34.15,15.54 34.15,16.8 29.91,21.04 29.91,25.8 29.26,26.45 29.26,27.83 26.6,30.49 23.26,30.49 v23.02,30.73
  Bottom 0.305: v43.02,11.12 v37.65,11.12
V50PU  (via drill 0.51)
  Top 0.254: IC5.6 39.98,9.61 | v36.64,13.15 36.64,11.12 38.15,9.61 39.98,9.61 | v39.98,8.87 39.98,9.61 | 23.34,31.43 v23.02,31.74 23.47,31.29 IC1.56
  Top 0.305: RN3.8 44.85,9.69 v44.03,8.87
  Bottom 0.254: v36.64,13.15 36.64,15.01 30.49,21.16 30.49,25.93 29.79,26.63 29.79,28 26.68,31.11 23.65,31.11 v23.02,31.74
  Bottom 0.305: v44.03,8.87 v39.98,8.87
VEXTERN  (via drill 0.51)
  Top 0.305: IC6.3 42.48,12.76 v45.27,12.76 46.58,12.76 RN1.1
  Bottom 0.457: v45.27,12.76 45.27,6.38 45.51,6.14 68.69,6.14 70.16,7.62 70.16,27.23 69.08,28.31 J4.4
VEXTPU  (via drill 0.51)
  Top 0.254: IC7.6 47.59,37.04 47.06,37.57 R21.1 43.87,38.51 36.25,38.51 35.47,37.73 32.13,37.73 31.96,37.56 IC1.37
  Top 0.305: IC7.6 IC7.5 48.24,34.21 v48.38,34.07 48.23,34.23 | IC7.13 IC7.12 49.55,31.19 v49.78,31.43
  Bottom 0.305: v49.78,31.43 49.78,32.67 v48.38,34.07
VPUN  (via drill 0.51)
  Top 0.305: IC7.3 IC7.2 50.2,35.1 v49.78,34.69 | IC7.9 47.59,29.26 47.76,29.09 48.7,29.09 48.9,29.29 IC7.11 48.9,31.94 49.32,32.36 51.03,32.36 v52.04,31.35 | RN1.3 48.32,11.89 v49.01,11.2
  Top 0.406: IC6.4 43.28,14.59 v43.56,14.31
  Bottom 0.305: v49.78,34.69 49.78,33.6 v52.04,31.35
  Bottom 0.406: v52.04,31.35 52.27,31.11 58.5,31.11 58.81,31.43 61.76,31.43 66.12,27.07 68.92,27.07 69.39,26.6 69.39,11.67 68.92,11.2 v49.01,11.2 45.9,14.31 v43.56,14.31
VREGEN  (via drill 0.51)
  Top 0.254: VR2.3 25.4,3.42 25.4,3.41 v25.4,2.54 | 25.4,8.57 VR3.3 25.4,8.54 v25.4,7.62 | R19.2 58.55,46 58.5,46.05 51.65,46.05 49.16,43.56 v44.18,43.56 | 22.58,28.29 IC1.62 21.88,28.29 v21.59,28.57 19.91,30.25 v19.91,31.43 19.21,31.43 18.67,30.88 R1.1 | v25.51,43.72 29.64,43.72 v29.87,43.56
  Bottom 0.254: v25.4,2.54 v25.4,7.62 24.12,7.62 18.05,13.69 18.05,27.38 19.29,28.63 21.54,28.63 v21.59,28.57 | v44.18,43.56 v29.87,43.56 | v19.91,31.43 19.91,42.63 21,43.72 v25.51,43.72
VUSB  (via drill 0.51)
  Top 0.305: IC7.14 50.84,29.01 52.01,27.84 C18.1 52.78,30.07 53.52,30.8 v53.52,32.05 | R13.1 v24.13,15.24 | IC6.5 41.69,14.16 41.23,13.69 40.6,13.69 40.29,13.38 40.29,10.97 | v43.56,3.08 43.56,8.09 42.94,8.71 42.16,8.71 41.69,9.18 IC5.5 41.69,10.19 40.91,10.97 40.29,10.97 | C19.1 40.29,10.97
  Bottom 0.254: 30.52,3.08 30.49,3.11
  Bottom 0.305: v24.13,15.24 24.13,10.72 26.76,8.09 26.76,6.84 30.49,3.11 | v53.52,32.05 53.83,31.74 56.16,31.74 56.63,32.2 70.94,32.2 72.19,30.96 72.19,7.08 68.19,3.08 v43.56,3.08 30.52,3.08
  pour Top (no thermals): 9.68,10.16 17.78,10.16 17.78,15.95 25.4,15.95 25.4,5.08 23.5,5.08 23.5,7.62 9.68,7.62

### Text on the board
tPlace: FEB 2018 | UART | TX | RX | GND | Ian Lesnet | I+S 2018 | v.trocio
bPlace: FEB 2018
tNames: B0 | B1 | PWR | USB | MODE | VREG | 3.3V | GND | SW- / DIO | SW- / CLK | Bus Pirate NG v1.0 | BOOT
bNames: PWR | USB | MODE | VREG | GND | +5V | 3V3 | VPU | ADC/DAC | Bus Pirate NG v1.0 | AUX | CS | MISO | CLK | MOSI | Fulfillment by | Seeed Studio | www.seeedstudio.com
tValues: vimark
Reference: GND | +5v | +3v3 | Vpu | USB | ADC/DAC | I/O header | AUX0 | CS | MISO | CLK | MOSI | BUS PIRATE NG v1.0 | CC-0 | Ian Lesnet FEB 2018 | http://dangerousprototypes.com